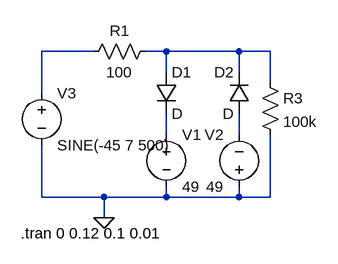
[diagram p0: schematic Limitador 50V.asc]
Limitador 50V.asc, the LTspice schematic file:
Version 4
SHEET 1 880 680
WIRE 112 128 32 128
WIRE 224 128 192 128
WIRE 336 128 224 128
WIRE 384 128 336 128
WIRE 224 160 224 128
WIRE 336 160 336 128
WIRE 384 176 384 128
WIRE 32 192 32 128
WIRE 224 256 224 224
WIRE 336 256 336 224
WIRE 32 352 32 272
WIRE 128 352 32 352
WIRE 224 352 224 336
WIRE 224 352 128 352
WIRE 336 352 336 336
WIRE 336 352 224 352
WIRE 384 352 384 256
WIRE 384 352 336 352
WIRE 128 384 128 352
FLAG 128 384 0
SYMBOL res 208 112 R90
WINDOW 0 0 56 VBottom 2
WINDOW 3 32 56 VTop 2
SYMATTR InstName R1
SYMATTR Value 100
SYMBOL res 368 160 R0
SYMATTR InstName R3
SYMATTR Value 100k
SYMBOL diode 208 160 R0
SYMATTR InstName D1
SYMBOL diode 352 224 R180
WINDOW 0 24 64 Left 2
WINDOW 3 24 0 Left 2
SYMATTR InstName D2
SYMBOL voltage 224 240 R0
WINDOW 123 0 0 Left 0
WINDOW 39 0 0 Left 0
SYMATTR InstName V1
SYMATTR Value 49
SYMBOL voltage 336 352 R180
WINDOW 0 24 96 Left 2
WINDOW 3 24 16 Left 2
WINDOW 123 0 0 Left 0
WINDOW 39 0 0 Left 0
SYMATTR InstName V2
SYMATTR Value 49
SYMBOL voltage 32 176 R0
WINDOW 123 0 0 Left 0
WINDOW 39 0 0 Left 0
SYMATTR InstName V3
SYMATTR Value SINE(-45 7 500)
TEXT 0 408 Left 2 !.tran 0 0.12 0.1 0.01

The netlist it stands for:
* Limitador 50V.asc
R1 N002 N001 100
R3 N002 0 100k
D1 N002 N003 D
D2 N004 N002 D
V1 N003 0 49
V2 0 N004 49
V3 N001 0 SINE(-45 7 500)
.model D D
.lib standard.dio
.tran 0 0.12 0.1 0.01
.backanno
.end